# Altium project PCB_ADF4007.PrjPCB
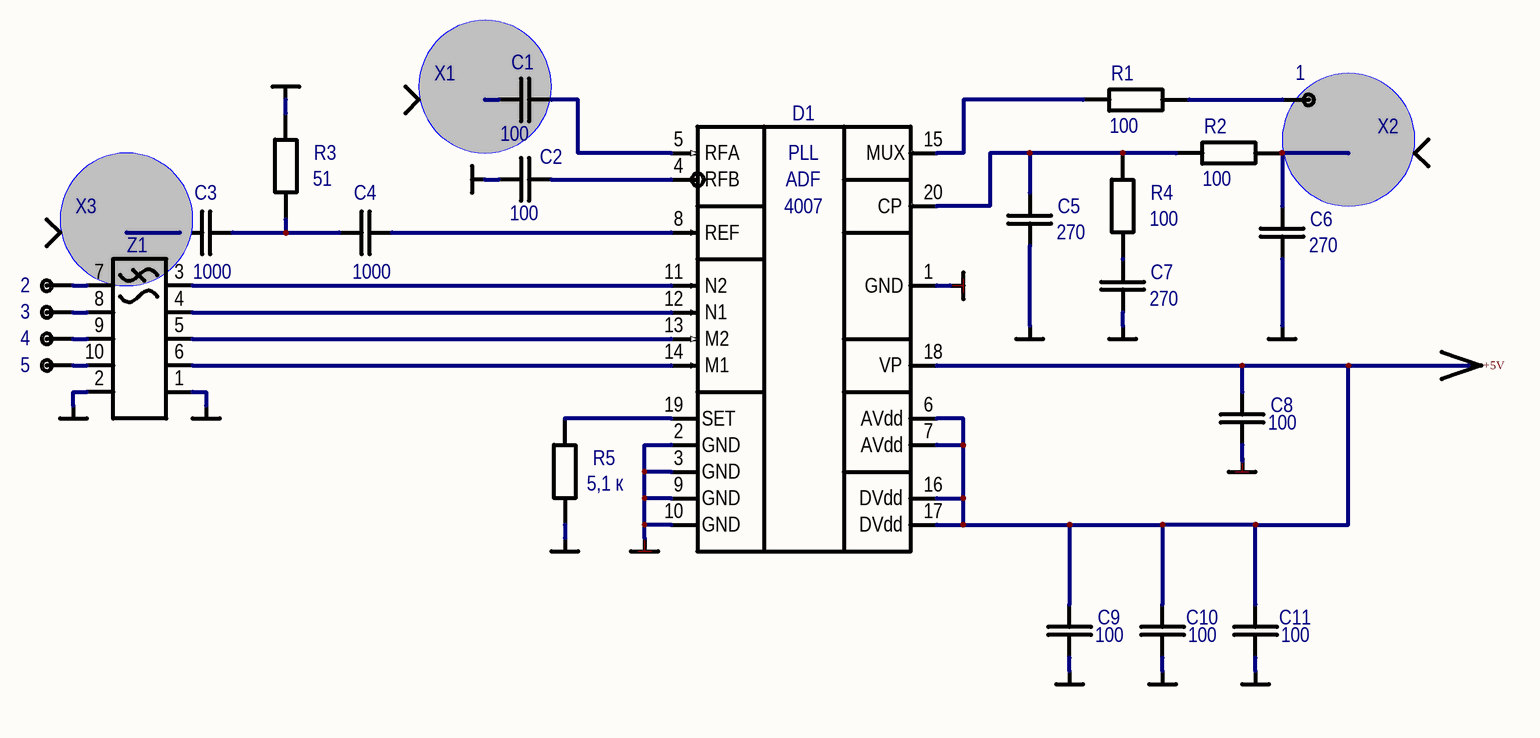
[diagram p0: 4007.SchDoc]
1 sheet, 41 parts. Net scope: global (net labels, ports and power ports of the same name join across sheets).
Board file: 4007.PcbDoc

## Sheet 4007.SchDoc: Синтезатор
size 420 x 297 mm; ApprovedBy: {Утвердил}; CheckedBy: Юдин Д.Г.; Author: {Копировал}; DrawnBy: Чернова Ю.Г.; Engineer: {Нач.сект.}; DocumentNumber: Э46653; SheetNumber: 1; SheetTotal: 1; Scale: {Масш.}; PageSetup: Record=PageOptions|CenterHorizontal=False|CenterVertical=False|PrintScale=0.33|XCorrection=0.00|YCorrection=0.00|PrintKind=1|BorderSize=5000000|LeftOffset=0|BottomOffset=0|Orientation=1|PaperLength=1000|PaperWidth=1000|Scale=100|PaperSource=15|PrintQuality=600|MediaType=1|DitherType=10|PaperKind=A4|PrintScaleMode=1; ProcessInspection: {Т.контр.}; Mass: {Масса}; NormInspection: {Н.контр.}; EngineerName: Быкадоров А.А.; Letter1Column: {}; Letter2Column: {}; Letter3Column: {}; DocumentType: ADF 4355; NachKonstrSekt: {Нач. КС}; NachPodrVydTz: {Нач.подр.выд.ТЗ}; NachSektNadezn: {Нач. СН}; ZamPoKonstr: {ZamPoKonstr}; ImagePath: {Перв. применение}; Rule: PcbType=ProtelPcb

### Parts
(Parts that share a designator on the sheet are numbered #1, #2 ... from top to bottom, then left to right.)
1  TP  [TP1]  (value not drawn)  (no BOM)
2  TP  [TP1]  (value not drawn)  (no BOM)
3  TP  [TP1]  (value not drawn)  (no BOM)
4  TP  [TP1]  (value not drawn)  (no BOM)
5  TP  [TP1]  (value not drawn)  (no BOM)
*#1  GND  (value not drawn)  (graphical)
*#2  GND  (value not drawn)  (graphical)
*#3  GND  (value not drawn)  (graphical)
*#4  GND  (value not drawn)  (graphical)
*#5  GND  (value not drawn)  (graphical)
*#6  VCC  (value not drawn)  (graphical)
*#7  GND  (value not drawn)  (graphical)
*#8  GND  (value not drawn)  (graphical)
*#9  GND  (value not drawn)  (graphical)
*#10  GND  (value not drawn)  (graphical)
*#11  GND  (value not drawn)  (graphical)
*#12  GND  (value not drawn)  (graphical)
*#13  GND  (value not drawn)  (graphical)
*?#1  GND  (value not drawn)  (graphical)
*?#2  GND  (value not drawn)  (graphical)
C1  100  [CAPC1005L]
C2  100  [CAPC1005L]
C3  1000  [CAPC1005L]
C4  1000  [CAPC1005L]
C5  270  [CAPC1608L]
C6  270  [CAPC1608L]
C7  270  [CAPC1608L]
C8  100  [CAPC1005L]
C9  100  [CAPC1005L]
C10  100  [CAPC1005L]
C11  100  [CAPC1005L]
D1  ADF4002BCPZ  [QFN50P400X400X100-20N]  (value not drawn)
R1  100  [RESC1005L]
R2  100  [RESC1005L]
R3  51  [RESC1005L]
R4  100  [RESC1005L]
R5  5,1 к  [RESC1005L]
X1  СРГ-50-751ФВ  [TP0.6X1]  (value not drawn)
X2  СРГ-50-751ФВ  [TP0.6X1]  (value not drawn)
X3  СРГ-50-751ФВ  [TP0.6X1]  (value not drawn)
Z1  NFA18SL****1A45  [FIL_NFA18SL]  (value not drawn)

### Nets
+5V: C8.1 C9.1 C10.1 C11.1 D1.6(AVdd) D1.7(AVdd) D1.16(DVdd) D1.17(DVdd) D1.18(VP)
GND: C2.1 C5.1 C6.1 C7.1 C8.2 C9.2 C10.2 C11.2 D1.1(GND) D1.2(GND) D1.3(GND) D1.9(GND) D1.10(GND) D1.EPAD R3.2 R5.1
Net1_1: 1.1 R1.1
Net2_1: 2.1 Z1.7
Net3_1: 3.1 Z1.8
Net4_1: 4.1 Z1.9
Net5_1: 5.1 Z1.10
NetC1_1: C1.1 X1.1
NetC1_2: C1.2 D1.5(RFA)
NetC2_2: C2.2 D1.4(RFB)
NetC3_1: C3.1 C4.2 R3.1
NetC3_2: C3.2 X3.1
NetC4_1: C4.1 D1.8(REF)
NetC5_2: C5.2 D1.20(CP) R2.2 R4.2
NetC6_2: C6.2 R2.1 X2.1
NetC7_2: C7.2 R4.1
NetD1_11: D1.11(N2) Z1.3
NetD1_12: D1.12(N1) Z1.4
NetD1_13: D1.13(M2) Z1.5
NetD1_14: D1.14(M1) Z1.6
NetD1_15: D1.15(MUX) R1.2
NetD1_19: D1.19(SET) R5.2

Not connected (* = marked no-connect by the designer): Z1 1(GND) 2(GND)

### Notes on the sheet
- Перв. примен.
- Справ. №
- Нач. подр. выд.ТЗ
- Подп. и дата
- Инв. № дубл.
- Взам. инв. №
- СН
- Изм.
- Лист
- № докум.
- Подп.
- Дата
- Лит.
- Масса
- Масштаб
- Т.контр.
- Пров.
- Разраб.
- Листов
- Нач. КС
- Инв. № подл.
- Н.контр.
- Утв.
- Копировал
- Формат А3
- (in symbol ADF4007BCPZ) PLL; ADF; 4007

### Library data of the parts
1-5 = TP: Test point
*#1-*#5 *#7-*#13 *?#1 *?#2 = GND: Корпус ЕСКД. Для "наложения" на штатный Power Bar
*#6 = VCC: Порт ЕСКД. Для "наложения" на штатный Power Bar
C1-C4 C8-C11 = C0402: Чип-конденсатор; Name: 0402; Power/Voltage: {Voltage}; TKE/TKC: {TKE/TKC}; Tolerance: {Tolerance}; Value: {Value}; BCPId: *; Manufacturer: *; ManufacturerPartNumber: *; Type: Конденсатор
C5-C7 = C0603: Чип-конденсатор; Name: 0603; Power/Voltage: {Voltage}; TKE/TKC: {TKE/TKC}; Tolerance: {Tolerance}; Value: {Value}; BCPId: *; Manufacturer: *; ManufacturerPartNumber: *; Type: Конденсатор
D1 = ADF4007BCPZ: Phase Detector/Frequency Synthesizer; Manufacturer: Analog Devices; Type: Микросхема; BCPId: *; Name: *; Package: CP-20-1 (LFCSP_VQ); ManufacturerPartNumber: ADF4002BCPZ
R1-R5 = R0402: Чип-резистор; Name: 0402; Tolerance: {Tolerance}; Value: {Value}; BCPId: *; Manufacturer: *; ManufacturerPartNumber: *; Type: Резистор
X1-X3 = СРГ-50-751ФВ: Переход; TU/GOST: ВР0.364.049 ТУ; BCPId: *; Name: *; ManufacturerPartNumber: СРГ-50-751ФВ; Type: Переход
Z1 = NFA18SL: LC filter 4-line array; Manufacturer*: Murata; BCPId: *; Type: Фильтр; ManufacturerPartNumber: NFA18SL****1A45; Package: 0603